# Altium schematic sheet CPU&POWER.SchDoc
size A4
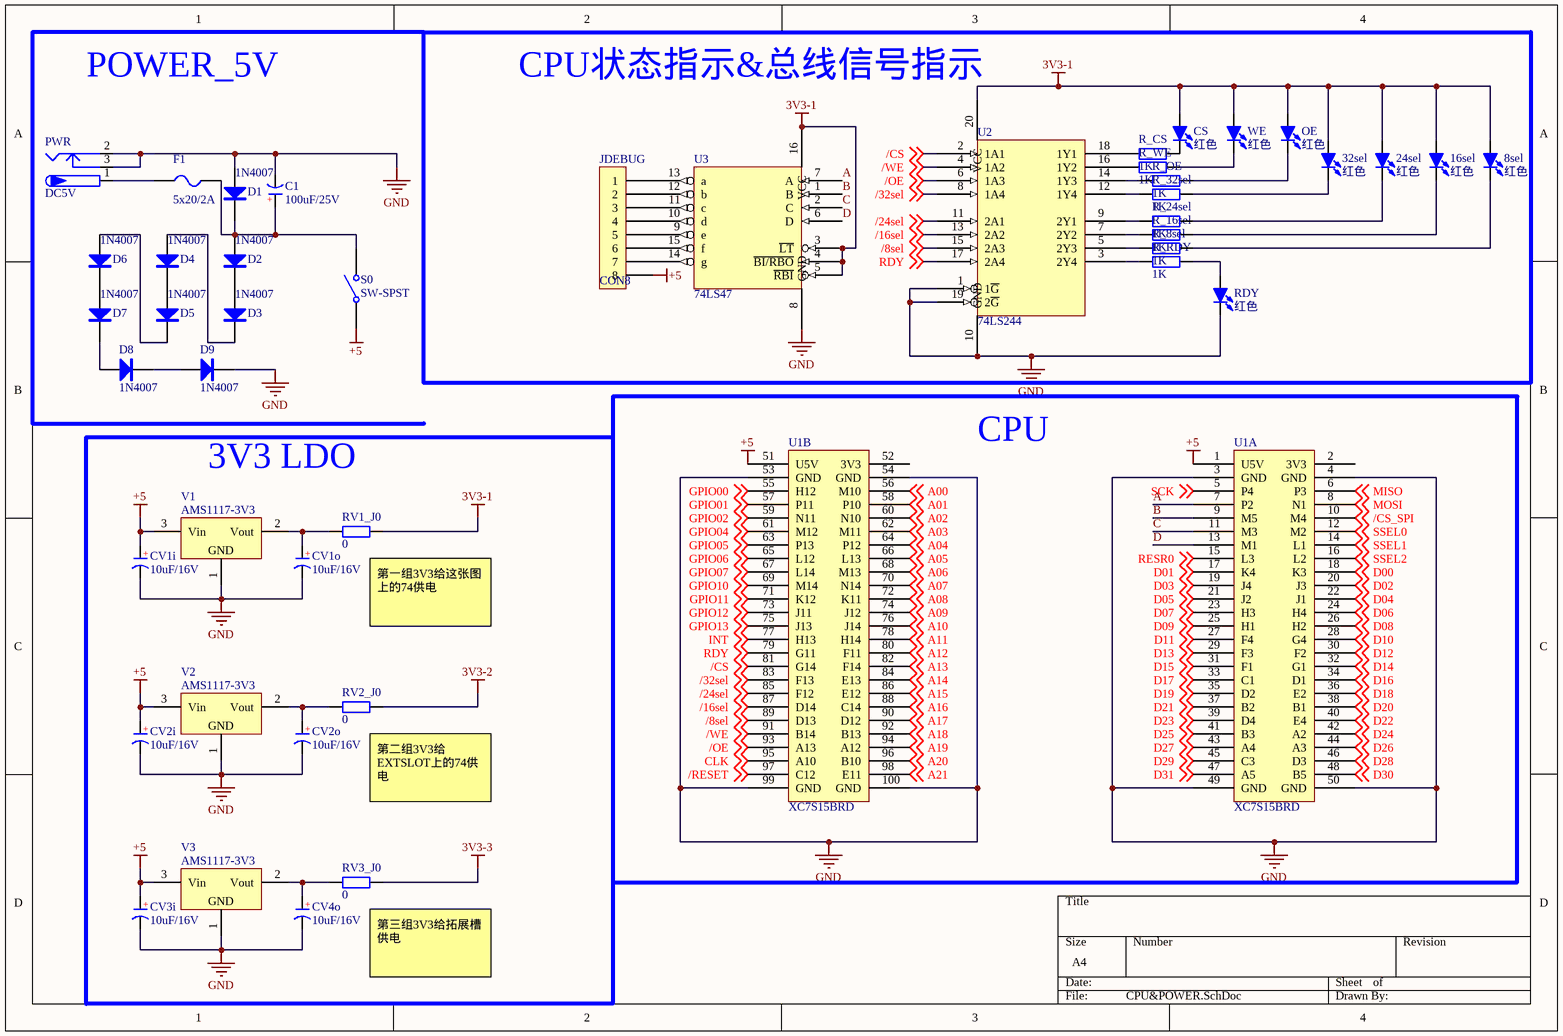
[diagram p0: CPU&POWER.SchDoc]

## Parts
8sel  红色  [LED 5MM-Y]
16sel  红色  [LED 5MM-YC]
24sel  红色  [LED 5MM-YC]
32sel  红色  [LED 5MM-YC]
C1  100uF/25V  [CAP3.0]
CS  红色  [LED 5MM-B]
CV1i  10uF/16V  [CAP2.54M]
CV1o  10uF/16V  [CAP2.54M]
CV2i  10uF/16V  [CAP2.54M]
CV2o  10uF/16V  [CAP2.54M]
CV3i  10uF/16V  [CAP2.54M]
CV4o  10uF/16V  [CAP2.54M]
D1  1N4007  [DO-41]
D2  1N4007  [DO-41]
D3  1N4007  [DO-41]
D4  1N4007  [DO-41]
D5  1N4007  [DO-41]
D6  1N4007  [DO-41]
D7  1N4007  [DO-41]
D8  1N4007  [DO-41]
D9  1N4007  [DO-41]
F1  5x20/2A  [FU 5x20]
JDEBUG  CON8  [SIP8]
OE  红色  [LED 5MM-B]
PWR  DC5V  [DC-005]
R_8sel  1K  [0805]
R_16sel  1K  [0805]
R_24sel  1K  [0805]
R_32sel  1K  [0805]
R_CS  1K  [0805]
R_OE  1K  [0805]
R_RDY  1K  [0805]
R_WE  1K  [0805]
RDY  红色  [LED 5MM-B]
RV1_J0  0  [0805]
RV2_J0  0  [0805]
RV3_J0  0  [0805]
S0  SW-SPST  [DIP6]
U1  XC7S15BRD  [XC7S15BRD]  (parts A,B of 2)
U2  74LS244  [SOJ-20]
U3  74LS47  [DIP-16]
V1  AMS1117-3V3  [SOT-223_手工焊接]
V2  AMS1117-3V3  [SOT-223_手工焊接]
V3  AMS1117-3V3  [SOT-223_手工焊接]
WE  红色  [LED 5MM-B]

## Blocks framed on the sheet
CPU状态指示&总线信号指示: 8sel 16sel 24sel 32sel CS JDEBUG OE R_8sel R_16sel R_24sel R_32sel R_CS R_OE R_RDY R_WE RDY U2 U3 WE
CPU: U1
3V3 LDO: CV1i CV1o CV2i CV2o CV3i CV4o RV1_J0 RV2_J0 RV3_J0 V1-V3

## Nets
3V3-1: 8sel.1(A) 16sel.1(A) 24sel.1(A) 32sel.1(A) CS.1(A) OE.1(A) RV1_J0.2 U2.20(VCC) U3.3(~{LT}) U3.4(~{BI/RBO}) U3.5(~{RBI}) U3.16(VCC) WE.1(A)  [also labelled VCC]
3V3-2: RV2_J0.2
3V3-3: RV3_J0.2
+5: CV1i.1(A) CV2i.1(A) CV3i.1(A) JDEBUG.8 S0.1(COMMON) U1.1(U5V) U1.51(U5V) V1.3(Vin) V2.3(Vin) V3.3(Vin)
GND: C1.2(K) CV1i.2(K) CV1o.2(K) CV2i.2(K) CV2o.2(K) CV3i.2(K) CV4o.2(K) D1.1(A) D9.2(K) PWR.2 PWR.3 RDY.2(K) U1.3(GND) U1.4(GND) U1.49(GND) U1.50(GND) U1.53(GND) U1.54(GND) U1.99(GND) U1.100(GND) U2.1(1~{G}) U2.10(GND) U2.19(2~{G}) U3.8(GND) V1.1(GND) V2.1(GND) V3.1(GND)
/8sel: U1.89(D13) U2.15(2A3) ; off-sheet /8sel
/16sel: U1.87(D14) U2.13(2A2) ; off-sheet /16sel
/24sel: U1.85(F12) U2.11(2A1) ; off-sheet /24sel
/32sel: U1.83(F13) U2.8(1A4) ; off-sheet /32sel
/CS: U1.81(G14) U2.2(1A1) ; off-sheet /CS
/CS_SPI: U1.10(M4) ; off-sheet /CS_SPI
/OE: U1.93(A13) U2.6(1A3) ; off-sheet /OE
/RESET: U1.97(C12) ; off-sheet /RESET
/WE: U1.91(B14) U2.4(1A2) ; off-sheet /WE
A: U1.7(P2) U3.7(A)
A00: U1.56(M10) ; off-sheet A00
A01: U1.58(P10) ; off-sheet A01
A02: U1.60(N10) ; off-sheet A02
A03: U1.62(M11) ; off-sheet A03
A04: U1.64(P12) ; off-sheet A04
A05: U1.66(L13) ; off-sheet A05
A06: U1.68(M13) ; off-sheet A06
A07: U1.70(N14) ; off-sheet A07
A08: U1.72(K11) ; off-sheet A08
A09: U1.74(J12) ; off-sheet A09
A10: U1.76(J14) ; off-sheet A10
A11: U1.78(H14) ; off-sheet A11
A12: U1.80(F11) ; off-sheet A12
A13: U1.82(F14) ; off-sheet A13
A14: U1.84(E13) ; off-sheet A14
A15: U1.86(E12) ; off-sheet A15
A16: U1.88(C14) ; off-sheet A16
A17: U1.90(D12) ; off-sheet A17
A18: U1.92(B13) ; off-sheet A18
A19: U1.94(A12) ; off-sheet A19
A20: U1.96(B10) ; off-sheet A20
A21: U1.98(E11) ; off-sheet A21
B: U1.9(M5) U3.1(B)
C: U1.11(M3) U3.2(C)
CLK: U1.95(A10) ; off-sheet CLK
D: U1.13(M1) U3.6(D)
D00: U1.18(K3) ; off-sheet D00
D01: U1.17(K4) ; off-sheet D01
D02: U1.20(J3) ; off-sheet D02
D03: U1.19(J4) ; off-sheet D03
D04: U1.22(J1) ; off-sheet D04
D05: U1.21(J2) ; off-sheet D05
D06: U1.24(H4) ; off-sheet D06
D07: U1.23(H3) ; off-sheet D07
D08: U1.26(H2) ; off-sheet D08
D09: U1.25(H1) ; off-sheet D09
D10: U1.28(G4) ; off-sheet D10
D11: U1.27(F4) ; off-sheet D11
D12: U1.30(F2) ; off-sheet D12
D13: U1.29(F3) ; off-sheet D13
D14: U1.32(G1) ; off-sheet D14
D15: U1.31(F1) ; off-sheet D15
D16: U1.34(D1) ; off-sheet D16
D17: U1.33(C1) ; off-sheet D17
D18: U1.36(E2) ; off-sheet D18
D19: U1.35(D2) ; off-sheet D19
D20: U1.38(B1) ; off-sheet D20
D21: U1.37(B2) ; off-sheet D21
D22: U1.40(E4) ; off-sheet D22
D23: U1.39(D4) ; off-sheet D23
D24: U1.42(A2) ; off-sheet D24
D25: U1.41(B3) ; off-sheet D25
D26: U1.44(A3) ; off-sheet D26
D27: U1.43(A4) ; off-sheet D27
D28: U1.46(D3) ; off-sheet D28
D29: U1.45(C3) ; off-sheet D29
D30: U1.48(B5) ; off-sheet D30
D31: U1.47(A5) ; off-sheet D31
GPIO00: U1.55(H12) ; off-sheet GPIO00
GPIO01: U1.57(P11) ; off-sheet GPIO01
GPIO02: U1.59(N11) ; off-sheet GPIO02
GPIO04: U1.61(M12) ; off-sheet GPIO04
GPIO05: U1.63(P13) ; off-sheet GPIO05
GPIO06: U1.65(L12) ; off-sheet GPIO06
GPIO07: U1.67(L14) ; off-sheet GPIO07
GPIO10: U1.69(M14) ; off-sheet GPIO10
GPIO11: U1.71(K12) ; off-sheet GPIO11
GPIO12: U1.73(J11) ; off-sheet GPIO12
GPIO13: U1.75(J13) ; off-sheet GPIO13
INT: U1.77(H13) ; off-sheet INT
MISO: U1.6(P3) ; off-sheet MISO
MOSI: U1.8(N1) ; off-sheet MOSI
RDY: U1.79(G11) U2.17(2A4) ; off-sheet RDY
RESR0: U1.15(L3) ; off-sheet RESR0
SCK: U1.5(P4) ; off-sheet SCK
SSEL0: U1.12(M2) ; off-sheet SSEL0
SSEL1: U1.14(L1) ; off-sheet SSEL1
SSEL2: U1.16(L2) ; off-sheet SSEL2
Net8sel_2: 8sel.2(K) R_8sel.2
Net16sel_2: 16sel.2(K) R_16sel.2
Net24sel_2: 24sel.2(K) R_24sel.2
Net32sel_2: 32sel.2(K) R_32sel.2
NetC1_1: C1.1(A) D1.2(K) D2.1(A) F1.1 S0.2(NO)
NetCS_2: CS.2(K) R_CS.2
NetCV1o_1: CV1o.1(A) RV1_J0.1 V1.2(Vout)
NetCV2o_1: CV2o.1(A) RV2_J0.1 V2.2(Vout)
NetCV4o_1: CV4o.1(A) RV3_J0.1 V3.2(Vout)
NetD2_2: D2.2(K) D3.1(A)
NetD3_2: D3.2(K) D4.1(A)
NetD4_2: D4.2(K) D5.1(A)
NetD5_2: D5.2(K) D6.1(A)
NetD6_2: D6.2(K) D7.1(A)
NetD7_2: D7.2(K) D8.1(A)
NetD8_2: D8.2(K) D9.1(A)
NetF1_2: F1.2 PWR.1
NetJDEBUG_1: JDEBUG.1 U3.13(a)
NetJDEBUG_2: JDEBUG.2 U3.12(b)
NetJDEBUG_3: JDEBUG.3 U3.11(c)
NetJDEBUG_4: JDEBUG.4 U3.10(d)
NetJDEBUG_5: JDEBUG.5 U3.9(e)
NetJDEBUG_6: JDEBUG.6 U3.15(f)
NetJDEBUG_7: JDEBUG.7 U3.14(g)
NetOE_2: OE.2(K) R_OE.2
NetR_8sel_1: R_8sel.1 U2.5(2Y3)
NetR_16sel_1: R_16sel.1 U2.7(2Y2)
NetR_24sel_1: R_24sel.1 U2.9(2Y1)
NetR_32sel_1: R_32sel.1 U2.12(1Y4)
NetR_CS_1: R_CS.1 U2.18(1Y1)
NetR_OE_1: R_OE.1 U2.14(1Y3)
NetR_RDY_1: R_RDY.1 U2.3(2Y4)
NetR_RDY_2: R_RDY.2 RDY.1(A)
NetR_WE_1: R_WE.1 U2.16(1Y2)
NetR_WE_2: R_WE.2 WE.2(K)

Not connected (* = marked no-connect by the designer): U1 2(3V3) 52(3V3)

## Notes on the sheet
- POWER_5V
- (near RV1_J0) 第一组3V3给这张图上的74供电
- (near RV2_J0) 第二组3V3给EXTSLOT上的74供电
- (near RV3_J0) 第三组3V3给拓展槽供电
- (in symbol C-CAP) +

## Library data of the parts
8sel 16sel 24sel 32sel CS OE RDY WE = LED-5MM: 5mm插件LED; 版权归属: 源创客; BOM名称: 5mm插件LED; 学习资源: www.ooocke.com
C1 CV1i CV1o CV2i CV2o CV3i CV4o = C-CAP: 直插电解电容; 版权归属: 源创客; BOM名称: 直插电解电容; 学习资源: www.ooocke.com
D1-D9 = 1N4007: 整流二极管; 版权归属: 源创客; BOM名称: 整流二极管; 学习资源: www.ooocke.com
F1 = FU DIP: 直插保险丝; 版权归属: 源创客; BOM名称: 直插保险丝; 学习资源: www.ooocke.com
JDEBUG = CON8: Connector
PWR = P-DC: 低压电源接口; BOM名称: DC电源接口; 版权归属: 源创客; 学习资源: www.ooocke.com
R_8sel R_16sel R_24sel R_32sel R_CS R_OE R_RDY R_WE RV1_J0 RV2_J0 RV3_J0 = R: 贴片电阻; 版权归属: 源创客; BOM名称: 贴片电阻; 学习资源: www.ooocke.com
S0 = SW-SPST: Single-Pole, Single-Throw Switch; pin to pad: 2>6; Published: 24-Mar-1999; LatestRevisionDate: 17-Jul-2002; LatestRevisionNote: Re-released for DXP Platform.; PackageReference: SPST-2; Publisher: Altium Limited; PackageDescription: Switch; 2 Leads
V1-V3 = AMS1117: 三端稳压芯片; BOM名称: 稳压芯片; 版权归属: 源创客; 学习资源: www.ooocke.com